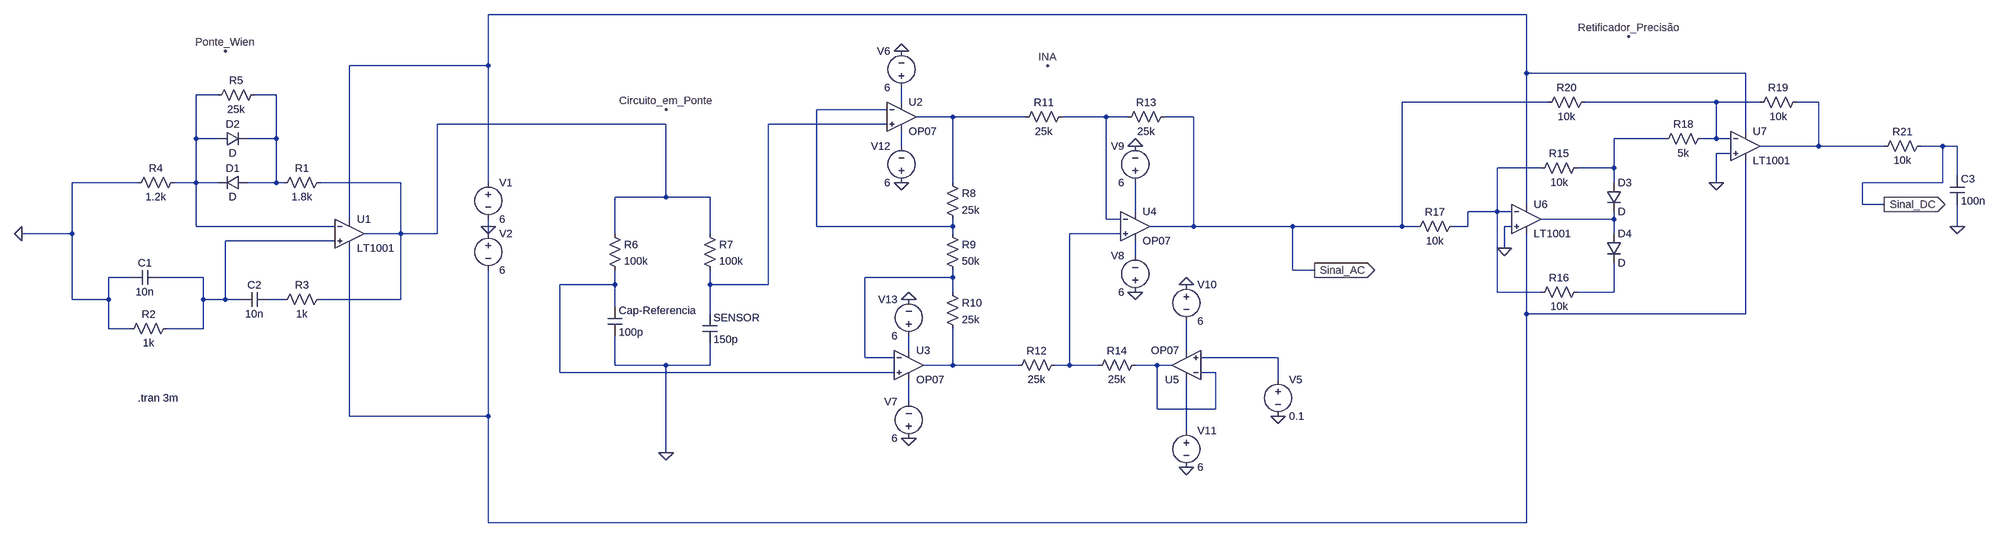
[diagram p0: schematic LevelSensor.asc]
LevelSensor.asc, the LTspice schematic file:
Version 4
SHEET 1 3780 1000
WIRE 2768 -400 336 -400
WIRE 336 -288 336 -400
WIRE 336 -288 32 -288
WIRE 2768 -272 2768 -400
WIRE 3248 -272 2768 -272
WIRE -256 -224 -304 -224
WIRE -128 -224 -176 -224
WIRE 1376 -208 1376 -240
WIRE 2816 -208 2496 -208
WIRE 3184 -208 2896 -208
WIRE 3280 -208 3184 -208
WIRE 3408 -208 3360 -208
WIRE 1344 -192 1152 -192
WIRE 1488 -176 1408 -176
WIRE 1648 -176 1488 -176
WIRE 1824 -176 1728 -176
WIRE 1872 -176 1824 -176
WIRE 2016 -176 1952 -176
WIRE 752 -160 224 -160
WIRE 1344 -160 976 -160
WIRE 3248 -144 3248 -272
WIRE -304 -128 -304 -224
WIRE -256 -128 -304 -128
WIRE -128 -128 -128 -224
WIRE -128 -128 -192 -128
WIRE 3072 -128 2960 -128
WIRE 3184 -128 3184 -208
WIRE 3184 -128 3152 -128
WIRE 3216 -128 3184 -128
WIRE 1376 -112 1376 -144
WIRE 3408 -112 3408 -208
WIRE 3408 -112 3280 -112
WIRE 3552 -112 3408 -112
WIRE 3680 -112 3632 -112
WIRE 3712 -112 3680 -112
WIRE 3216 -96 3184 -96
WIRE 2800 -64 2704 -64
WIRE 2960 -64 2960 -128
WIRE 2960 -64 2880 -64
WIRE 3712 -48 3712 -112
WIRE -432 -32 -576 -32
WIRE -304 -32 -304 -128
WIRE -304 -32 -352 -32
WIRE -256 -32 -304 -32
WIRE -128 -32 -128 -128
WIRE -128 -32 -192 -32
WIRE -112 -32 -128 -32
WIRE 144 -32 -32 -32
WIRE 336 -32 336 -288
WIRE 1488 -32 1488 -176
WIRE 2960 -32 2960 -64
WIRE 3184 -32 3184 -96
WIRE 3680 -32 3680 -112
WIRE 3680 -32 3504 -32
WIRE 752 0 752 -160
WIRE 752 0 640 0
WIRE 848 0 752 0
WIRE 2768 16 2768 -272
WIRE 3504 16 3504 -32
WIRE 3552 16 3504 16
WIRE 1888 32 1888 -32
WIRE 2704 32 2704 -64
WIRE 2704 32 2640 32
WIRE 2736 32 2704 32
WIRE 32 48 32 -288
WIRE 1824 48 1824 -176
WIRE 1856 48 1824 48
WIRE 2960 48 2960 32
WIRE 2960 48 2800 48
WIRE -304 64 -304 -32
WIRE 0 64 -304 64
WIRE 336 64 336 48
WIRE 1152 64 1152 -192
WIRE 1488 64 1488 48
WIRE 1488 64 1152 64
WIRE 2016 64 2016 -176
WIRE 2016 64 1920 64
WIRE 2256 64 2016 64
WIRE 2496 64 2496 -208
WIRE 2496 64 2256 64
WIRE 2528 64 2496 64
WIRE 2640 64 2640 32
WIRE 2640 64 2608 64
WIRE 2736 64 2720 64
WIRE 3712 64 3712 16
WIRE -576 80 -576 -32
WIRE -576 80 -704 80
WIRE 144 80 144 -32
WIRE 144 80 64 80
WIRE 224 80 224 -160
WIRE 224 80 144 80
WIRE 336 80 336 64
WIRE 640 80 640 0
WIRE 848 80 848 0
WIRE 1488 80 1488 64
WIRE 1856 80 1744 80
WIRE 2960 80 2960 48
WIRE 0 96 -240 96
WIRE 2720 112 2720 64
WIRE 1888 128 1888 96
WIRE 2256 160 2256 64
WIRE 2304 160 2256 160
WIRE -448 176 -496 176
WIRE -288 176 -384 176
WIRE 1488 176 1488 160
WIRE 1488 176 1296 176
WIRE 640 192 640 160
WIRE 640 192 496 192
WIRE 848 192 848 160
WIRE 976 192 976 -160
WIRE 976 192 848 192
WIRE 1488 208 1488 176
WIRE 2704 208 2704 32
WIRE 2800 208 2704 208
WIRE 2960 208 2960 144
WIRE 2960 208 2880 208
WIRE -576 224 -576 80
WIRE -496 224 -496 176
WIRE -496 224 -576 224
WIRE -288 224 -288 176
WIRE -240 224 -240 96
WIRE -240 224 -288 224
WIRE -208 224 -240 224
WIRE -112 224 -144 224
WIRE 144 224 144 80
WIRE 144 224 -32 224
WIRE 640 240 640 192
WIRE 848 256 848 192
WIRE 2768 256 2768 80
WIRE 3248 256 3248 -80
WIRE 3248 256 2768 256
WIRE -496 288 -496 224
WIRE -448 288 -496 288
WIRE -288 288 -288 224
WIRE -288 288 -368 288
WIRE 1392 336 1392 304
WIRE 2000 336 2000 272
WIRE 1296 352 1296 176
WIRE 1360 352 1296 352
WIRE 2224 352 2032 352
WIRE 640 368 640 304
WIRE 752 368 640 368
WIRE 848 368 848 320
WIRE 848 368 752 368
WIRE 1488 368 1488 288
WIRE 1488 368 1424 368
WIRE 1632 368 1488 368
WIRE 1744 368 1744 80
WIRE 1744 368 1712 368
WIRE 1808 368 1744 368
WIRE 1936 368 1888 368
WIRE 1968 368 1936 368
WIRE 496 384 496 192
WIRE 1360 384 496 384
WIRE 2064 384 2032 384
WIRE 2224 400 2224 352
WIRE 1392 448 1392 400
WIRE 1936 464 1936 368
WIRE 2064 464 2064 384
WIRE 2064 464 1936 464
WIRE 32 480 32 112
WIRE 336 480 336 160
WIRE 336 480 32 480
WIRE 2000 512 2000 400
WIRE 752 560 752 368
WIRE 336 720 336 480
WIRE 2768 720 2768 256
WIRE 2768 720 336 720
FLAG 336 64 0
FLAG 2224 480 0
FLAG 1376 -320 0
FLAG 1888 -112 0
FLAG 1392 528 0
FLAG 2000 592 0
FLAG 2000 192 0
FLAG 1888 208 0
FLAG 1376 -32 0
FLAG 1392 224 0
FLAG 2720 112 0
FLAG 3184 -32 0
FLAG 752 560 0
FLAG -704 80 0
FLAG -240 -320 Ponte_Wien
FLAG 752 -192 Circuito_em_Ponte
FLAG 1696 -288 INA
FLAG 2992 -352 Retificador_Precisão
FLAG 3712 64 0
FLAG 2304 160 Sinal_AC
IOPIN 2304 160 Out
FLAG 3552 16 Sinal_DC
IOPIN 3552 16 Out
SYMBOL voltage 336 -48 R0
WINDOW 123 0 0 Left 2
WINDOW 39 0 0 Left 2
SYMATTR InstName V1
SYMATTR Value 6
SYMBOL voltage 336 64 R0
WINDOW 123 0 0 Left 2
WINDOW 39 0 0 Left 2
SYMATTR InstName V2
SYMATTR Value 6
SYMBOL Opamps\\LT1001 32 16 R0
SYMATTR InstName U1
SYMBOL res -16 -48 R90
WINDOW 0 0 56 VBottom 2
WINDOW 3 32 56 VTop 2
SYMATTR InstName R1
SYMATTR Value 1.8k
SYMBOL cap -448 192 R270
WINDOW 0 32 32 VTop 2
WINDOW 3 0 32 VBottom 2
SYMATTR InstName C1
SYMATTR Value 10n
SYMBOL res -464 304 R270
WINDOW 0 32 56 VTop 2
WINDOW 3 0 56 VBottom 2
SYMATTR InstName R2
SYMATTR Value 1k
SYMBOL cap -208 240 R270
WINDOW 0 32 32 VTop 2
WINDOW 3 0 32 VBottom 2
SYMATTR InstName C2
SYMATTR Value 10n
SYMBOL res -128 240 R270
WINDOW 0 32 56 VTop 2
WINDOW 3 0 56 VBottom 2
SYMATTR InstName R3
SYMATTR Value 1k
SYMBOL res -336 -48 R90
WINDOW 0 0 56 VBottom 2
WINDOW 3 32 56 VTop 2
SYMATTR InstName R4
SYMATTR Value 1.2k
SYMBOL diode -192 -48 R90
WINDOW 0 0 32 VBottom 2
WINDOW 3 32 32 VTop 2
SYMATTR InstName D1
SYMBOL diode -256 -112 R270
WINDOW 0 32 32 VTop 2
WINDOW 3 0 32 VBottom 2
SYMATTR InstName D2
SYMBOL res -160 -240 R90
WINDOW 0 0 56 VBottom 2
WINDOW 3 32 56 VTop 2
SYMATTR InstName R5
SYMATTR Value 25k
SYMBOL cap 832 256 R0
SYMATTR InstName SENSOR
SYMATTR Value 150p
SYMBOL res 624 64 R0
SYMATTR InstName R6
SYMATTR Value 100k
SYMBOL res 832 64 R0
SYMATTR InstName R7
SYMATTR Value 100k
SYMBOL cap 624 240 R0
SYMATTR InstName Cap-Referencia
SYMATTR Value 100p
SYMBOL res 1472 -48 R0
SYMATTR InstName R8
SYMATTR Value 25k
SYMBOL res 1472 64 R0
SYMATTR InstName R9
SYMATTR Value 50k
SYMBOL res 1472 192 R0
SYMATTR InstName R10
SYMATTR Value 25k
SYMBOL res 1744 -192 R90
WINDOW 0 0 56 VBottom 2
WINDOW 3 32 56 VTop 2
SYMATTR InstName R11
SYMATTR Value 25k
SYMBOL res 1728 352 R90
WINDOW 0 0 56 VBottom 2
WINDOW 3 32 56 VTop 2
SYMATTR InstName R12
SYMATTR Value 25k
SYMBOL res 1968 -192 R90
WINDOW 0 0 56 VBottom 2
WINDOW 3 32 56 VTop 2
SYMATTR InstName R13
SYMATTR Value 25k
SYMBOL res 1904 352 R90
WINDOW 0 0 56 VBottom 2
WINDOW 3 32 56 VTop 2
SYMATTR InstName R14
SYMATTR Value 25k
SYMBOL voltage 2224 384 R0
WINDOW 123 0 0 Left 2
WINDOW 39 0 0 Left 2
SYMATTR InstName V5
SYMATTR Value 0.1
SYMBOL voltage 1376 -224 R180
WINDOW 0 24 96 Left 2
WINDOW 3 24 16 Left 2
WINDOW 123 0 0 Left 2
WINDOW 39 0 0 Left 2
SYMATTR InstName V6
SYMATTR Value 6
SYMBOL voltage 1392 544 R180
WINDOW 0 24 96 Left 2
WINDOW 3 24 16 Left 2
WINDOW 123 0 0 Left 2
WINDOW 39 0 0 Left 2
SYMATTR InstName V7
SYMATTR Value 6
SYMBOL voltage 1888 224 R180
WINDOW 0 24 96 Left 2
WINDOW 3 24 16 Left 2
WINDOW 123 0 0 Left 2
WINDOW 39 0 0 Left 2
SYMATTR InstName V8
SYMATTR Value 6
SYMBOL voltage 1888 -16 R180
WINDOW 0 24 96 Left 2
WINDOW 3 24 16 Left 2
WINDOW 123 0 0 Left 2
WINDOW 39 0 0 Left 2
SYMATTR InstName V9
SYMATTR Value 6
SYMBOL voltage 2000 176 R0
WINDOW 123 0 0 Left 2
WINDOW 39 0 0 Left 2
SYMATTR InstName V10
SYMATTR Value 6
SYMBOL voltage 2000 496 R0
WINDOW 123 0 0 Left 2
WINDOW 39 0 0 Left 2
SYMATTR InstName V11
SYMATTR Value 6
SYMBOL voltage 1376 -16 R180
WINDOW 0 24 96 Left 2
WINDOW 3 24 16 Left 2
WINDOW 123 0 0 Left 2
WINDOW 39 0 0 Left 2
SYMATTR InstName V12
SYMATTR Value 6
SYMBOL voltage 1392 320 R180
WINDOW 0 24 96 Left 2
WINDOW 3 24 16 Left 2
WINDOW 123 0 0 Left 2
WINDOW 39 0 0 Left 2
SYMATTR InstName V13
SYMATTR Value 6
SYMBOL Opamps\\OP07 1376 -240 R0
SYMATTR InstName U2
SYMBOL Opamps\\OP07 1392 304 R0
SYMATTR InstName U3
SYMBOL Opamps\\OP07 1888 0 R0
SYMATTR InstName U4
SYMBOL Opamps\\OP07 2000 432 R180
SYMATTR InstName U5
SYMBOL Opamps\\LT1001 2768 -16 R0
SYMATTR InstName U6
SYMBOL diode 2944 -32 R0
SYMATTR InstName D3
SYMBOL res 2896 -80 R90
WINDOW 0 0 56 VBottom 2
WINDOW 3 32 56 VTop 2
SYMATTR InstName R15
SYMATTR Value 10k
SYMBOL res 2896 192 R90
WINDOW 0 0 56 VBottom 2
WINDOW 3 32 56 VTop 2
SYMATTR InstName R16
SYMATTR Value 10k
SYMBOL res 2624 48 R90
WINDOW 0 0 56 VBottom 2
WINDOW 3 32 56 VTop 2
SYMATTR InstName R17
SYMATTR Value 10k
SYMBOL diode 2944 80 R0
SYMATTR InstName D4
SYMBOL Opamps\\LT1001 3248 -176 R0
SYMATTR InstName U7
SYMBOL res 3168 -144 R90
WINDOW 0 0 56 VBottom 2
WINDOW 3 32 56 VTop 2
SYMATTR InstName R18
SYMATTR Value 5k
SYMBOL res 3376 -224 R90
WINDOW 0 0 56 VBottom 2
WINDOW 3 32 56 VTop 2
SYMATTR InstName R19
SYMATTR Value 10k
SYMBOL res 2912 -224 R90
WINDOW 0 0 56 VBottom 2
WINDOW 3 32 56 VTop 2
SYMATTR InstName R20
SYMATTR Value 10k
SYMBOL res 3648 -128 R90
WINDOW 0 0 56 VBottom 2
WINDOW 3 32 56 VTop 2
SYMATTR InstName R21
SYMATTR Value 10k
SYMBOL cap 3696 -48 R0
SYMATTR InstName C3
SYMATTR Value 100n
TEXT -432 440 Left 2 !.tran 3m

The netlist it stands for:
* LevelSensor.asc
V1 N001 0 6
V2 0 N024 6
XU1 N018 N002 N001 N024 N010 LT1001  ; pins In+ In- V+ V- OUT
R1 N010 N003 1.8k
C1 0 N018 10n
R2 0 N018 1k
C2 N018 N023 10n
R3 N023 N010 1k
R4 N002 0 1.2k
D1 N003 N002 D
D2 N002 N003 D
R5 N003 N002 25k
C§SENSOR N011 0 150p
R6 N010 N021 100k
R7 N010 N011 100k
Cap-Referencia N021 0 100p
R8 N008 N007 25k
R9 N007 N020 50k
R10 N020 N028 25k
R11 N009 N008 25k
R12 N017 N028 25k
R13 Sinal_AC N009 25k
R14 N029 N017 25k
V5 N027 0 0.1
V6 N004 0 6
V7 0 N030 6
V8 0 N019 6
V9 N015 0 6
V10 0 N026 6
V11 N031 0 6
V12 0 N013 6
V13 N025 0 6
XU2 N011 N007 N004 N013 N008 LT1001  ; OP07, pins In+ In- V+ V- OUT
XU3 N021 N020 N025 N030 N028 LT1001  ; OP07, pins In+ In- V+ V- OUT
XU4 N017 N009 N015 N019 Sinal_AC LT1001  ; OP07, pins In+ In- V+ V- OUT
XU5 N027 N029 N031 N026 N029 LT1001  ; OP07, pins In+ In- V+ V- OUT
XU6 0 N014 N001 N024 N016 LT1001  ; pins In+ In- V+ V- OUT
D3 N012 N016 D
R15 N012 N014 10k
R16 N022 N014 10k
R17 N014 Sinal_AC 10k
D4 N016 N022 D
XU7 0 N005 N001 N024 N006 LT1001  ; pins In+ In- V+ V- OUT
R18 N005 N012 5k
R19 N006 N005 10k
R20 N005 Sinal_AC 10k
R21 Sinal_DC N006 10k
C3 Sinal_DC 0 100n
.model D D
.lib standard.dio
.tran 3m
.lib LTC.lib
.backanno
.end